# EAGLE design GRBL-Control (EAGLE 9.3.0)
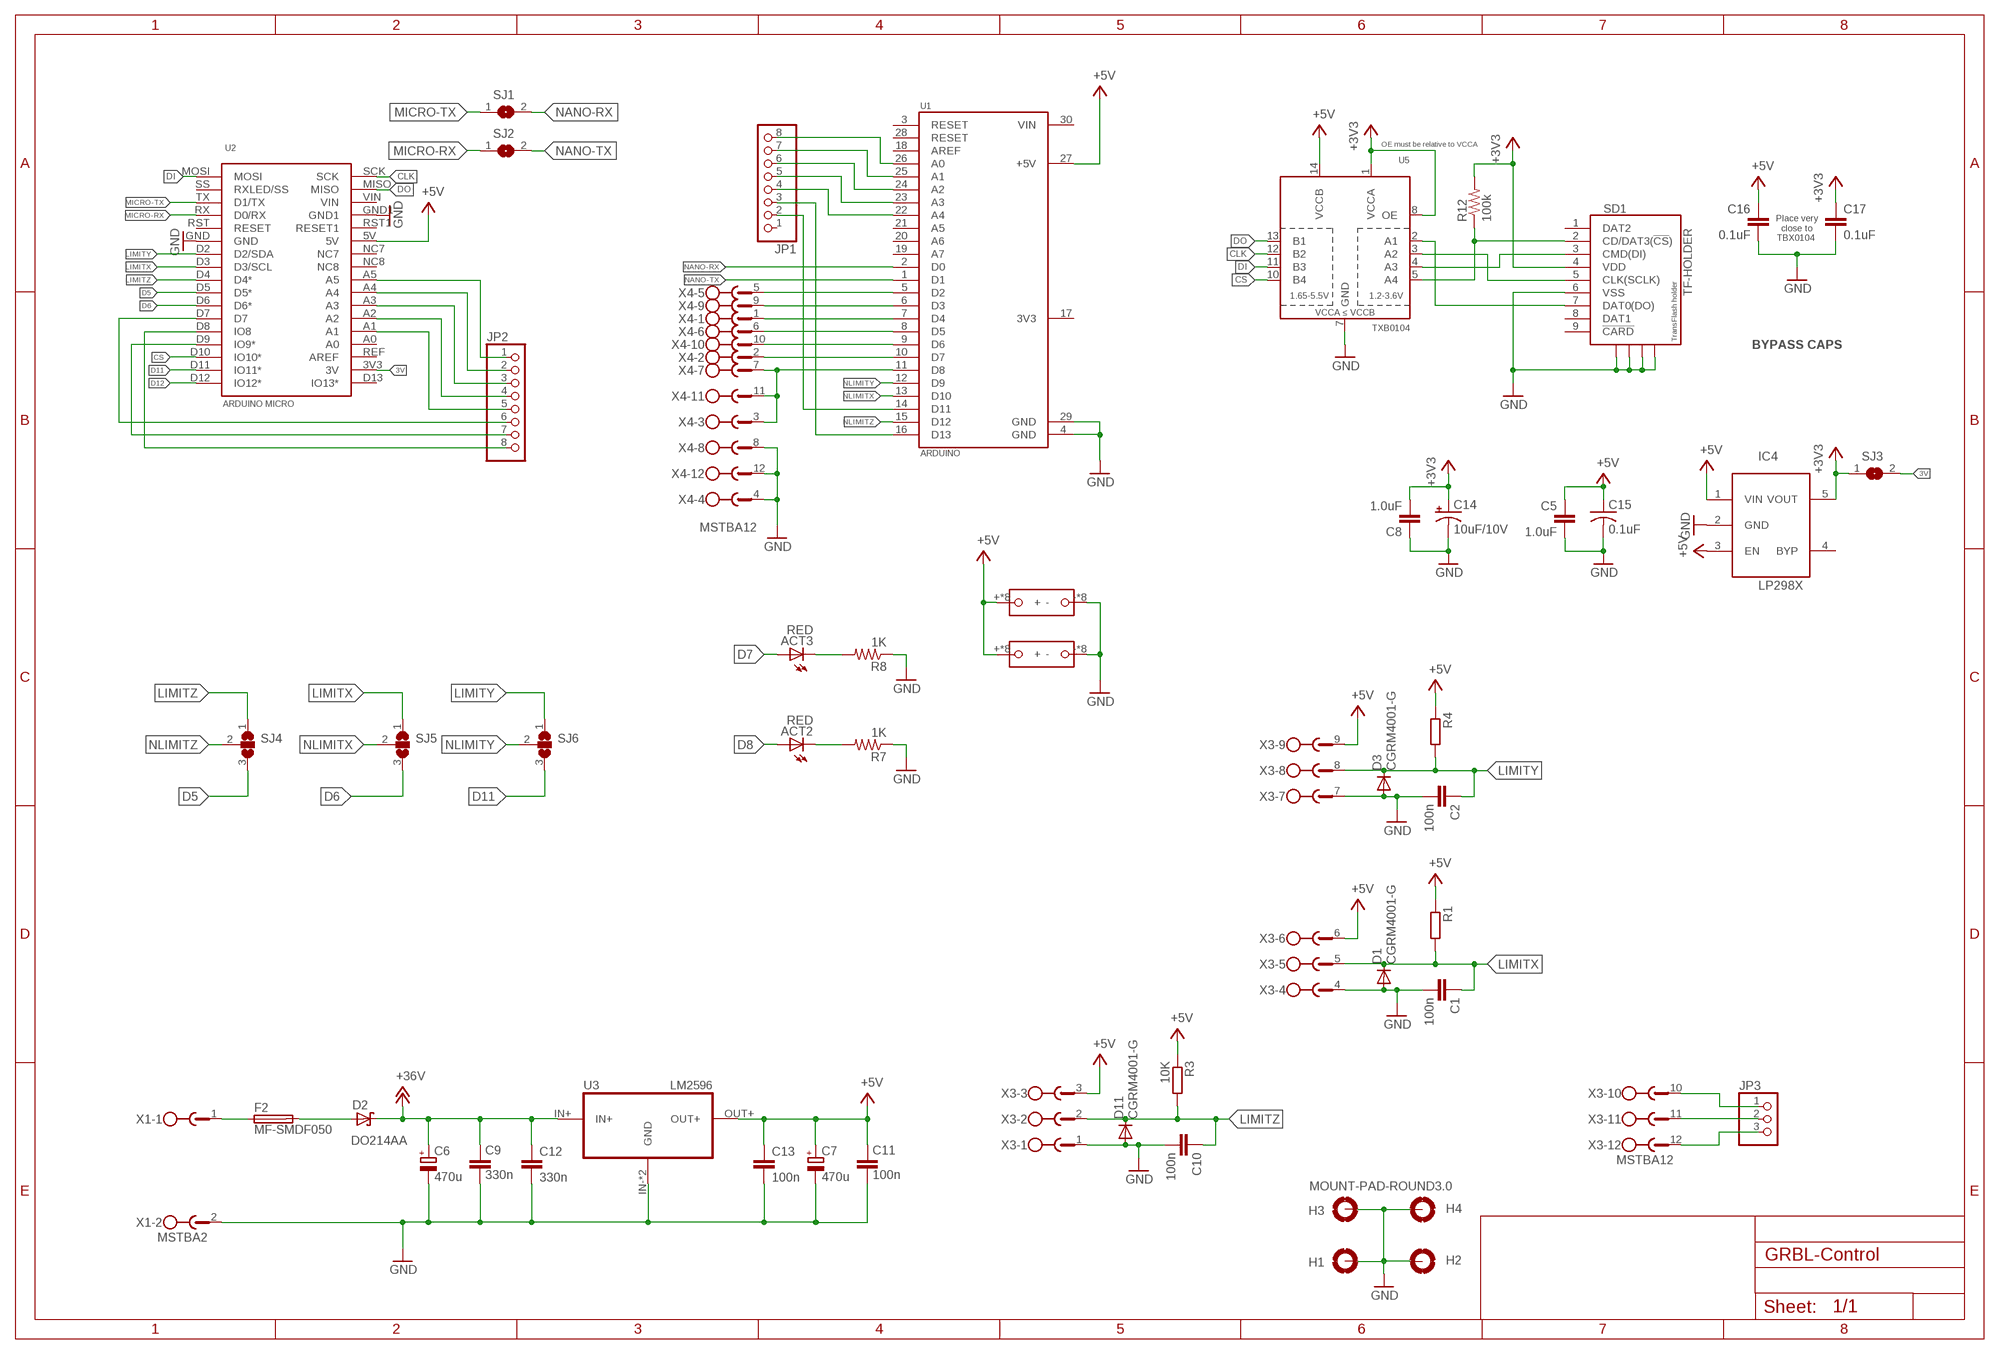
[diagram p0: schematic, sheet 1]

## Parts
ACT2  RED  LEDCHIP-LED0805  [CHIP-LED0805]
ACT3  RED  LEDCHIP-LED0805  [CHIP-LED0805]
C1  100n  C-EUC0603  [C0603]
C2  100n  C-EUC0603  [C0603]
C5  1.0uF  1.0UF-16V-10%(0603)  [0603-CAP]
C6  470u  CPOL-EUE3.5-8  [E3,5-8]
C7  470u  CPOL-EUE3.5-8  [E3,5-8]
C8  1.0uF  1.0UF-16V-10%(0603)  [0603-CAP]
C9  330n  C-EUC0603  [C0603]
C10  100n  C-EUC0603  [C0603]
C11  100n  C-EUC0603  [C0603]
C12  330n  C-EU050-025X075  [C050-025X075]
C13  100n  C-EU050-025X075  [C050-025X075]
C14  10uF/10V  CPOL-USA/3216-18R  [A/3216-18R]
C15  0.1uF  C-USC0805K  [C0805K]
C16  0.1uF  0.1UF-25V(+80/-20%)(0603)  [0603-CAP]
C17  0.1uF  0.1UF-25V(+80/-20%)(0603)  [0603-CAP]
D1  CGRM4001-G  [SOD-123_MINI-SMA]
D2  DO214AA  MBRS130LT3  [SMB]
D3  CGRM4001-G  [SOD-123_MINI-SMA]
D11  CGRM4001-G  [SOD-123_MINI-SMA]
F2  MF-SMDF050  [MF-SMDF050]
H1  MOUNT-PAD-ROUND3.0  [3,0-PAD]
H2  MOUNT-PAD-ROUND3.0  [3,0-PAD]
H3  MOUNT-PAD-ROUND3.0  [3,0-PAD]
H4  MOUNT-PAD-ROUND3.0  [3,0-PAD]
IC4  LP298XS  [SOT23-5L]
JP1  PINHD-1X8BIG  [1X08-BIG]
JP2  PINHD-1X8BIG  [1X08-BIG]
JP3  PINHD-1X3  [1X03]
R1  R-EU_R0603  [R0603]
R3  10K  R-EU_R0603  [R0603]
R4  R-EU_R0603  [R0603]
R7  1K  R-US_R0805  [R0805]
R8  1K  R-US_R0805  [R0805]
R12  100k  100KOHM-1/10W-1%(0603)  [0603-RES]
SD1  TF-HOLDER  [TF-PULL]
SJ1  SJ  [SJ]
SJ2  SJ  [SJ]
SJ3  SJ  [SJ]
SJ4  SJ2W  [SJ_2]
SJ5  SJ2W  [SJ_2]
SJ6  SJ2W  [SJ_2]
U1  ARDUINO  [ARDUINO_A000005]
U2  ARDUINO MICRO  ARDUINO_MICROFOOTPRINT  [ARDUINO-MICRO]
U3  LM2596  LM2596-DCDC  [BUCK-LM2596]
U5  TXB0104  TXB0104PWRSOIC14  [SO14]
U$1  DEV_GRID  [DEV_GRID]
U$2  DEV_GRID  [DEV_GRID]
X1  MSTBA2  [MSTBA2]
X3  MSTBA12  [MSTBA12]
X4  MSTBA12  [MSTBA12]

## Nets
3V: SJ3.2 U2.3V3(3V)
12V-IN: F2.1 X1.1
!CS_3V3: R12.1 SD1.2(CD/DAT3(!CS!)) U5.5(A4)
+3V3: C8.2 C14.+ C17.1 IC4.5(VOUT) R12.2 SD1.4(VDD) SJ3.1 U5.1(VCCA) U5.8(OE)
+5V: C5.1 C7.+ C11.1 C13.1 C15.1 C16.1 IC4.1(VIN) IC4.3(EN) R1.1 R3.1 R4.1 U1.27(+5V) U2.5V U3.OUT+ U5.14(VCCB) U$1.+ U$1.P$49(+) U$1.P$50(+) U$1.P$51(+) U$1.P$52(+) U$1.P$53(+) U$1.P$54(+) U$1.P$55(+) U$2.+ U$2.P$49(+) U$2.P$50(+) U$2.P$51(+) U$2.P$52(+) U$2.P$53(+) U$2.P$54(+) U$2.P$55(+) X3.3 X3.6 X3.9
+36V: C6.+ C9.1 C12.1 D2.C U3.IN+
A1: JP2.5 U2.A1
A2: JP2.4 U2.A2
A3: JP2.3 U2.A3
A4: JP2.2 U2.A4
A5: JP2.1 U2.A5
CLK: U2.SCK U5.12(B2)
CLK_3V3: SD1.5(CLK(SCLK)) U5.3(A2)
CS: U2.D10(IO10*) U5.10(B4)
D5: SJ4.3 U2.D5(D5*)
D6: SJ5.3 U2.D6(D6*)
D7: ACT3.A JP2.6 U2.D7
D8: ACT2.A JP2.8 U2.D8(IO8)
D9: JP2.7 U2.D9(IO9*)
D11: SJ6.3 U2.D11(IO11*)
D12: U2.D12(IO12*)
DI: U2.MOSI U5.11(B3)
DI_3V3: SD1.3(CMD(DI)) U5.4(A3)
DIRX: U1.8(D5) X4.6
DIRY: U1.9(D6) X4.10
DO: U2.MISO U5.13(B1)
DO_3V3: SD1.7(DAT0(DO)) U5.2(A1)
GND: C1.2 C2.2 C5.2 C6.- C7.- C8.1 C9.2 C10.2 C11.2 C12.2 C13.2 C14.- C15.2 C16.2 C17.2 D1.A D3.A D11.A H1.B3,0(MOUNT) H1.P$1(MOUNT) H1.P$2(MOUNT) H1.P$3(MOUNT) H1.P$4(MOUNT) H1.P$5(MOUNT) H1.P$6(MOUNT) H1.P$7(MOUNT) H1.P$8(MOUNT) H2.B3,0(MOUNT) H2.P$1(MOUNT) H2.P$2(MOUNT) H2.P$3(MOUNT) H2.P$4(MOUNT) H2.P$5(MOUNT) H2.P$6(MOUNT) H2.P$7(MOUNT) H2.P$8(MOUNT) H3.B3,0(MOUNT) H3.P$1(MOUNT) H3.P$2(MOUNT) H3.P$3(MOUNT) H3.P$4(MOUNT) H3.P$5(MOUNT) H3.P$6(MOUNT) H3.P$7(MOUNT) H3.P$8(MOUNT) H4.B3,0(MOUNT) H4.P$1(MOUNT) H4.P$2(MOUNT) H4.P$3(MOUNT) H4.P$4(MOUNT) H4.P$5(MOUNT) H4.P$6(MOUNT) H4.P$7(MOUNT) H4.P$8(MOUNT) IC4.2(GND) R7.1 R8.1 SD1.6(VSS) SD1.S1 SD1.S2 SD1.S3 SD1.S4 U1.4(GND) U1.29(GND) U2.GND U2.GND1 U3.IN-(GND) U3.OUT-(GND) U5.7(GND) U$1.- U$1.P$57(-) U$1.P$58(-) U$1.P$59(-) U$1.P$60(-) U$1.P$61(-) U$1.P$62(-) U$1.P$63(-) U$2.- U$2.P$57(-) U$2.P$58(-) U$2.P$59(-) U$2.P$60(-) U$2.P$61(-) U$2.P$62(-) U$2.P$63(-) X1.2 X3.1 X3.4 X3.7 X4.4 X4.8 X4.12
LIMITX: C1.1 D1.C R1.2 SJ5.1 U2.D3(D3/SCL) X3.5
LIMITY: C2.1 D3.C R4.2 SJ6.1 U2.D2(D2/SDA) X3.8
LIMITZ: C10.1 D11.C R3.2 SJ4.1 U2.D4(D4*) X3.2
MICRO-RX: SJ2.1 U2.RX(D0/RX)
MICRO-TX: SJ1.1 U2.TX(D1/TX)
N$1: ACT2.C R7.2
N$2: ACT3.C R8.2
N$3: D2.A F2.2
N$4: U1.7(D4) X4.1
N$5: U1.10(D7) X4.2
N$6: JP1.8 U1.26(A0)
N$7: JP1.7 U1.25(A1)
N$8: JP1.6 U1.24(A2)
N$9: JP1.5 U1.23(A3)
N$10: JP1.4 U1.22(A4)
N$11: JP1.3 U1.16(D13)
N$12: JP1.2 U1.14(D11)
N$13: JP3.1 X3.10
N$14: JP3.2 X3.11
N$15: JP3.3 X3.12
NANO-RX: SJ1.2 U1.2(D0)
NANO-TX: SJ2.2 U1.1(D1)
NLIMITX: SJ5.2 U1.13(D10)
NLIMITY: SJ6.2 U1.12(D9)
NLIMITZ: SJ4.2 U1.15(D12)
STEP-EN: U1.11(D8) X4.3 X4.7 X4.11
STEPX: U1.5(D2) X4.5
STEPY: U1.6(D3) X4.9
Unconnected: IC4.4(BYP) JP1.1 SD1.1(DAT2) SD1.8(DAT1) SD1.9(!CARD) U1.3(RESET) U1.17(3V3) U1.18(AREF) U1.19(A7) U1.20(A6) U1.21(A5) U1.28(RESET) U2.A0 U2.D13(IO13*) U2.NC7 U2.NC8 U2.REF(AREF) U2.RST1(RESET1) U2.RST(RESET) U2.SS(RXLED/SS) U2.VIN

## Notes on the sheet
- OE must be relative to VCCA
- Place very
  close to
  TBX0104
- BYPASS CAPS

## Power pins joined to a net without a drawn wire
VIN: U1.30(VIN)

## Library data of the parts
ACT2 ACT3 = adafruit:LED: LED OSRAM: - CHIPLED LG R971, LG N971, LY N971, LG Q971, LY Q971, LO R971, LY R971 LH N974, LH R974 LS Q976, LO Q976, LY Q976 LO Q996 - Hyper CHIPLED LW Q18S LB Q993, LB Q99A, LB R99A - SideLED LS A670, LO A670, LY A670, LG A670, LP A670 LB A673, LV A673, LT A673, LW A673 LH A674 LY A675 LS A676, LA A676, LO A676, LY A676, LW A676 LS A679, LY A679, LG A679 - Hyper Micro SIDELED® LS Y876, LA Y876, LO Y876, LY Y876 LT Y87S - SmartLED LW L88C, LW L88S LB L89C, LB L89S, LG L890 LS L89K, LO L89K, LY L89K LS L896, LA L896, LO L896, LY L896 - TOPLED LS T670, LO T670, LY T670, LG T670, LP T670 LSG T670, LSP T670, LSY T670, LOP T670, LYG T670 LG T671, LOG T671, LSG T671 LB T673, LV T673, LT T673, LW T673 LH T674 LS T676, LA T676, LO T676, LY T676, LB T676, LH T676, LSB T676, LW T676 LB T67C, LV T67C, LT T67C, LS T67K, LO T67K, LY T67K, LW E67C LS E67B, LA E67B, LO E67B, LY E67B, LB E67C, LV E67C, LT E67C LW T67C LS T679, LY T679, LG T679 LS T770, LO T770, LY T770, LG T770, LP T770 LB T773, LV T773, LT T773, LW T773 LH T774 LS E675, LA E675, LY E675, LS T675 LS T776, LA T776, LO T776, LY T776, LB T776 LHGB T686 LT T68C, LB T68C - Hyper Mini TOPLED® LB M676 - Mini TOPLED Santana® LG M470 LS M47K, LO M47K, LY M47K Source: http://www.osram.convergy.de/
C1 C2 C9-C11 = Parts:C-EU: CAPACITOR, European symbol
C5 C8 = SparkFun-Capacitors:1.0UF-16V-10%(0603): CAP-00868; PROD_ID: CAP-00868
C6 C7 = RavinLib:CPOL-EU: POLARIZED CAPACITOR, European symbol
C12 C13 = RavinLib:C-EU: CAPACITOR, European symbol
C14 = adafruit:CPOL-US: POLARIZED CAPACITOR, American symbol
C15 = adafruit:C-US: CAPACITOR, American symbol
C16 C17 = SparkFun-Capacitors:0.1UF-25V(+80/-20%)(0603): CAP-00810 Ceramic Standard decoupling cap; PROD_ID: CAP-00810
D1 D3 D11 = Parts:CGRM400*-G: Molded plasitc,JEDEC SOD-123/Mini SMA Source: Comchip CGRM4001-G.pdf
D2 = diode:MBRS130LT3: Schottky Power Rectifier Source: http://www.onsemi.com/pub/Collateral/MBRS130LT3-D.PDF; PART-NO: DO214AA
F2 = fuse:MF-SMDF: MF-SMDF Series - PRC Resettable Fuses Source: http://www.farnell.com/datasheets/716597.pdf
H1-H4 = QuestNode:MOUNT-PAD-ROUND: MOUNTING PAD, round
IC4 = adafruit:LP298X
JP1 JP2 = adafruit:PINHD-1X8: PIN HEADER
JP3 = pinhead:PINHD-1X3: PIN HEADER
R1 R3 R4 = Parts:R-EU_: RESISTOR, European symbol
R7 R8 = adafruit:R-US_: RESISTOR, American symbol
R12 = SparkFun-Resistors:100KOHM-1/10W-1%(0603): RES-07828; PROD_ID: RES-07828
SD1 = sd-mmc:TF-HOLDER: TF / Micro SD socket is PUSH-PUSH type, the card can be pushed into and auto locked and pushed out by simply press the card. Surface Mounting type.
SJ1-SJ3 = jumper:SJ: SMD solder JUMPER
SJ4-SJ6 = jumper:SJ2W: SMD solder JUMPER
U1 = Parts:ARDUINO: MICRO, ARDUINO NANO 3.0, MINI-B USB, ATmega328, 0.1"DIP, ICSP HDR
U2 = arduino-micro:ARDUINO_MICRO
U3 = QuestNode:LM2596-DCDC
U5 = SparkFun-DigitalIC:TXB0104PWR: 4-Bit Bi-Directional Level Shifter 1.2V-3.6V (VCCA) to 1.65V-5.5V (VCCB) bi-directional level shifter with auto direction sensing. Max data rate - VCCA 1.8V: 20Mbps (50ns), VCCA 3.3V: 100Mbps (10ns) Digikey: 296-21929-1-ND (TSSOP) IC-11329; PROD_ID: IC-11329
U$1 U$2 = Components:DEV_GRID
X1 = Parts:MSTBA2: PHOENIX; MF: FARNELL; MPN: 1757242; OC_FARNELL: 3705171; OC_NEWARK: 71C4161
X3 X4 = con-phoenix-508:MSTBA12: PHOENIX; MPN: 1757349; OC_FARNELL: 3705250; OC_NEWARK: 71C4169

## Board
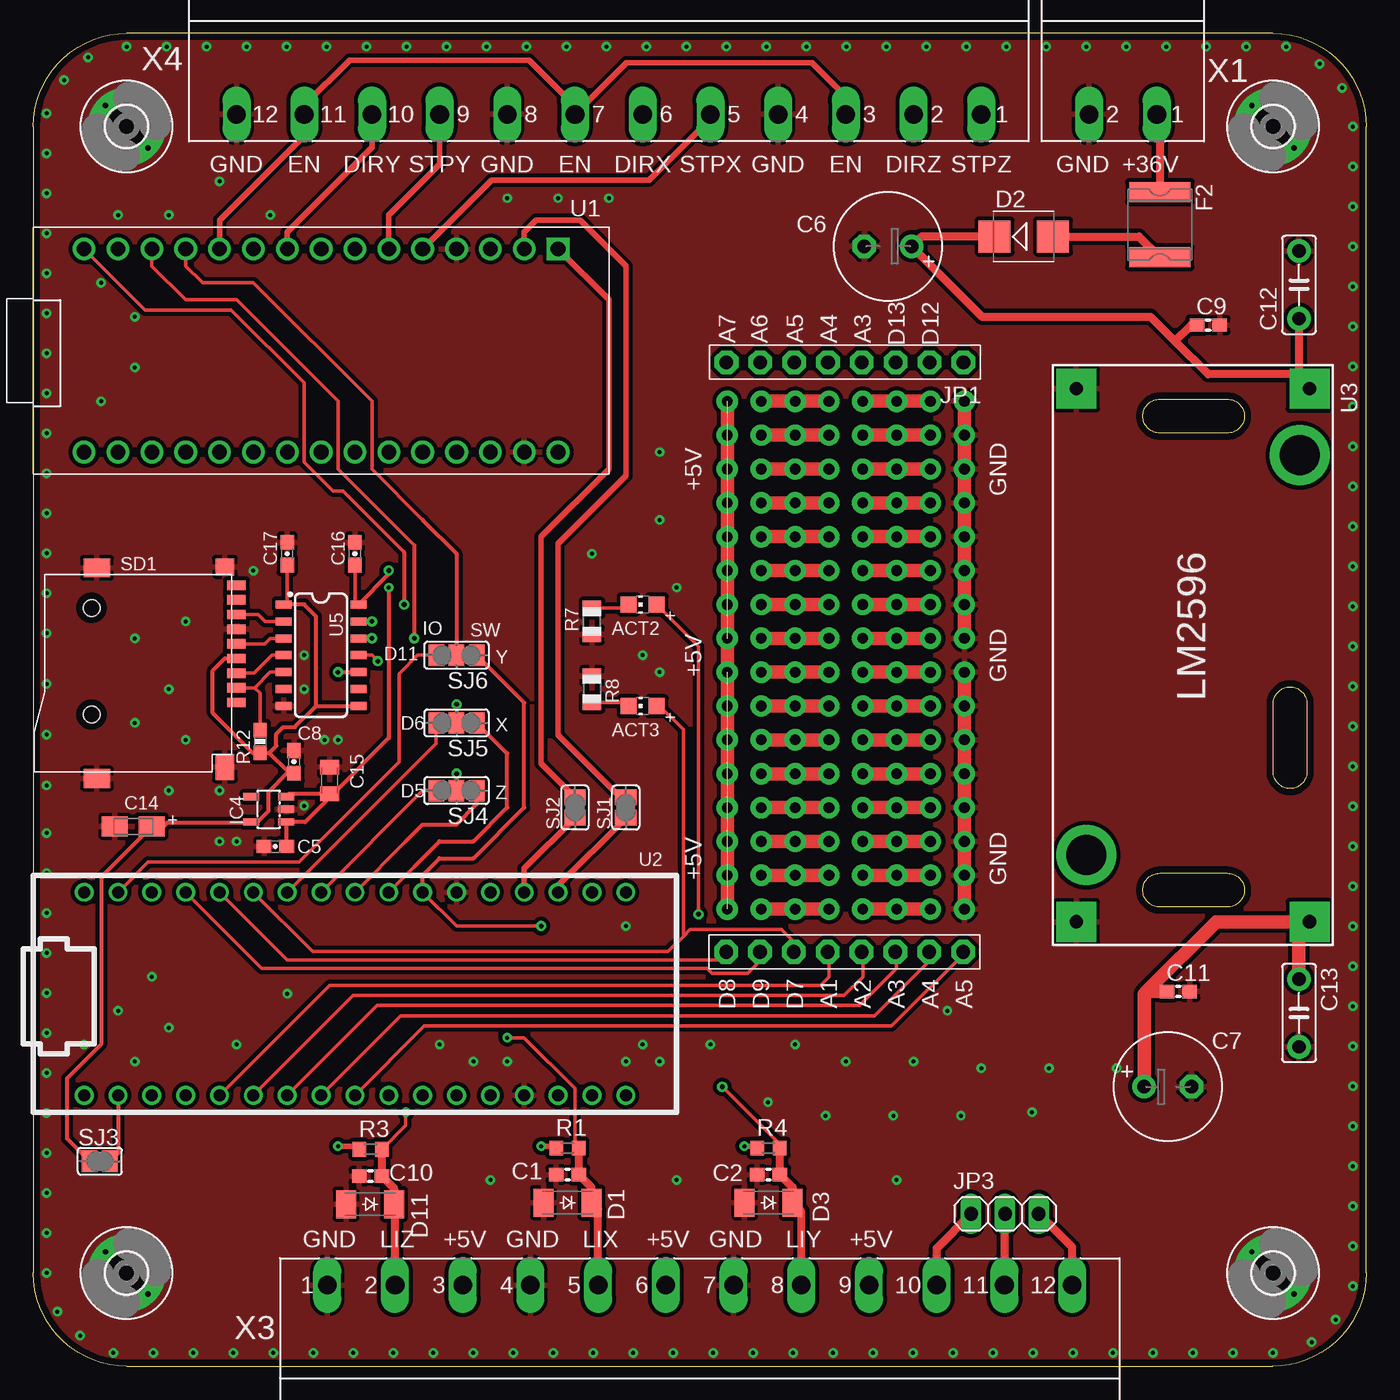
[diagram p1: board, top side]
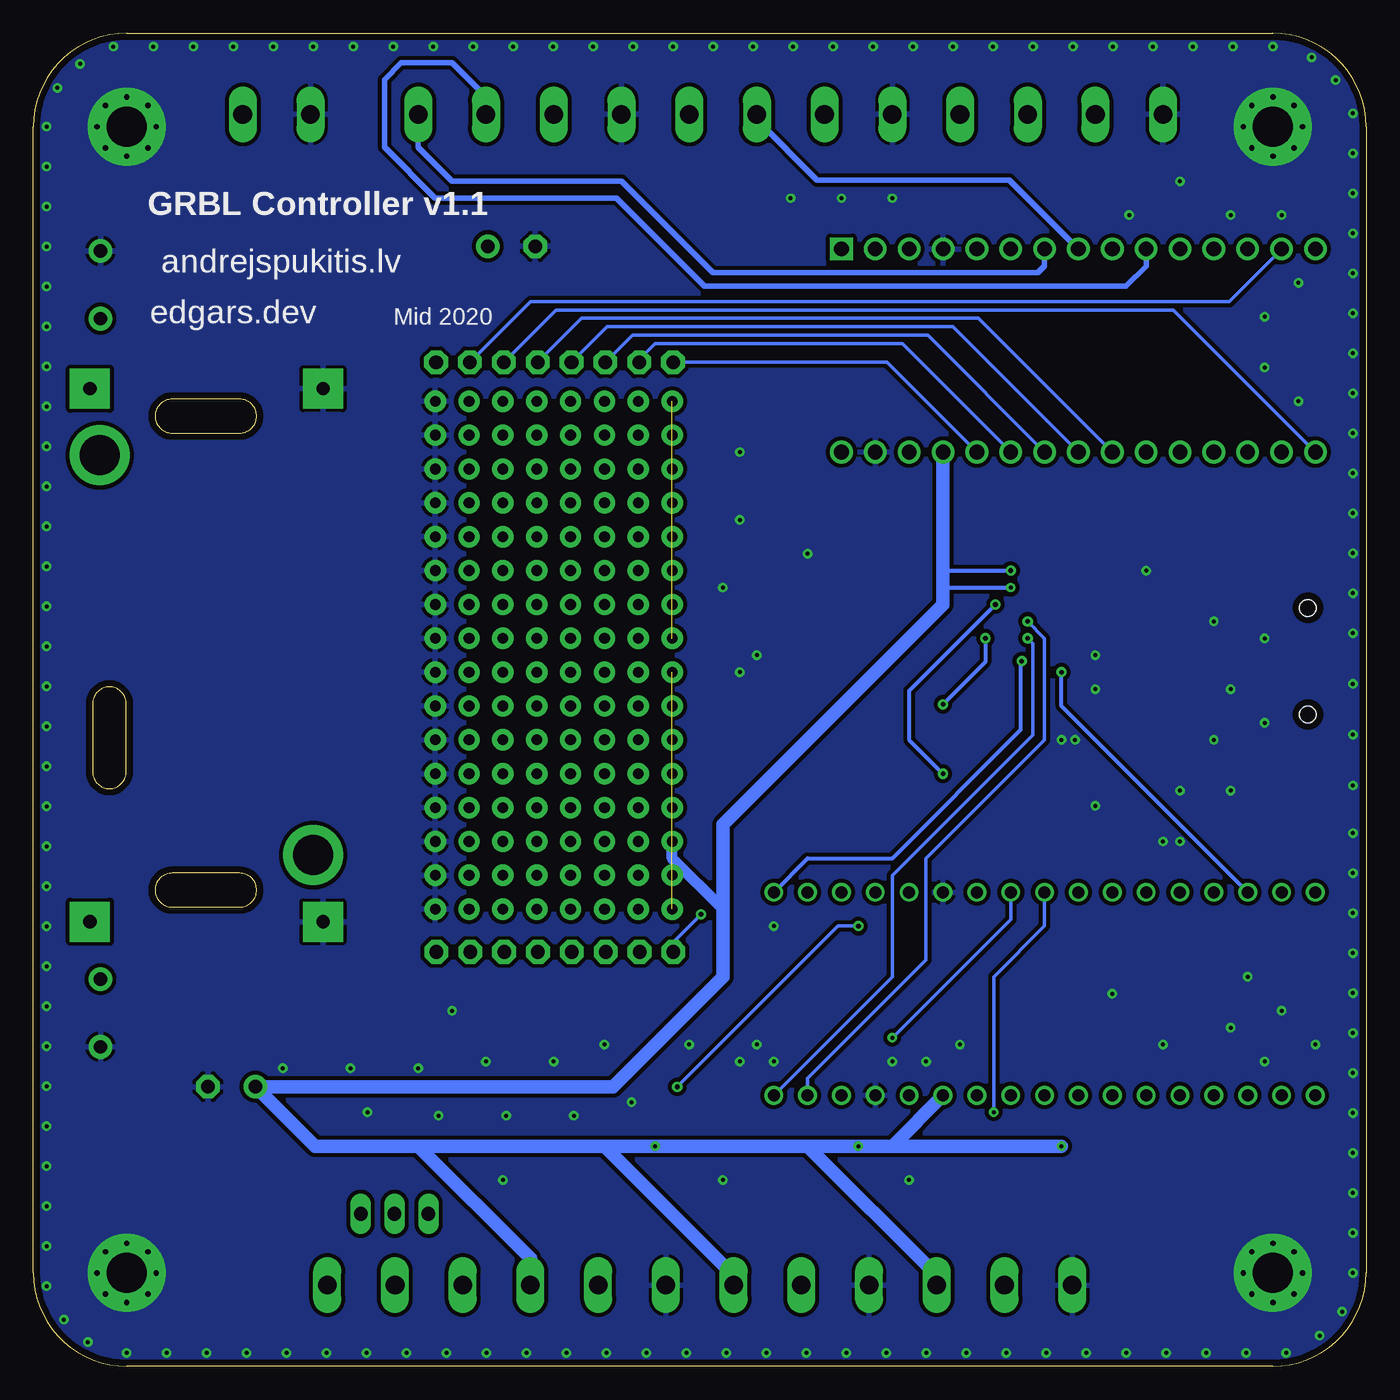
[diagram p2: board, bottom side, seen from below]

Size 100 x 100 mm. Coordinates in mm from the lower left corner, seen from the top.
Outline: 7,0 93,0 arc90 100,7 100,93 arc90 93,100 7,100 arc90 0,93 0,7 arc90 7,0
Copper layers (1*16): Top 0.035mm / dielectric 1.5mm / Bottom 0.035mm
Design rules "default *": minimum track width 6mil, minimum drill 0.3mm, track to track 12mil, track to pad 12mil, pad to pad 6mil, via to via 6mil, smd to smd 6mil, copper to edge 20mil, drill to drill 6mil, minimum pad ring 10mil, minimum via ring 8mil, stop-mask expansion 4mil, vias tented up to drill 0.3mm, thermal gap 10mil

### Footprints (pad centres in the part's own frame; a part is rotated, then mirrored left to right if it is on the bottom)
CHIP-LED0805 = smd 1.2 x 1.2: A 0,-1.05; C 0,1.05
C0603 = smd 1.1 x 1: 1 -0.85,0; 2 0.85,0
0603-CAP = smd 1.1 x 1: 1 -0.85,0; 2 0.85,0
E3,5-8 = drill 1 pad 1.778: + -1.778,0 | drill 1 pad 1.778 octagon: - 1.778,0
C050-025X075 = drill 1 pad 1.778: 1 -2.54,0; 2 2.54,0
A/3216-18R = smd 1.95 x 1.5: + 1.375,0; - -1.375,0
C0805K = smd 1.1 x 1.4: 1 -1,0; 2 1,0
SOD-123_MINI-SMA = smd 1.5 x 2.1: A 1.8,0; C -1.8,0
SMB = smd 2.4 x 2.4: A 2.2,0; C -2.2,0
MF-SMDF050 = smd 1.5 x 4.6: 1 -2.45,0; 2 2.45,0
3,0-PAD = drill 3 pad 5.842: B3,0 0,0 | drill 0.4: P$1 0,2.223; P$2 0,-2.223; P$3 -2.223,0; P$4 2.223,0; P$5 -1.587,1.587; P$6 -1.587,-1.587; P$7 1.587,-1.587; P$8 1.587,1.587
SOT23-5L = smd 0.55 x 1.2: 1 -0.95,-1.3; 2 0,-1.3; 3 0.95,-1.3; 4 0.95,1.3; 5 -0.95,1.3
1X08-BIG = drill 1.016 pad 1.778 octagon: 1 -8.89,0; 2 -6.35,0; 3 -3.81,0; 4 -1.27,0; 5 1.27,0; 6 3.81,0; 7 6.35,0; 8 8.89,0
1X03 = drill 1.016 long: 1 -2.54,0; 2 0,0; 3 2.54,0
R0603 = smd 1 x 1.1: 1 -0.85,0; 2 0.85,0
R0805 = smd 1.1 x 1.4: 1 -1,0; 2 1,0
0603-RES = smd 1.1 x 1: 1 -0.85,0; 2 0.85,0
TF-PULL = smd 0.7 x 1.4: 1 -2.2,-7.62; 2 -1.1,-7.62; 3 0,-7.62; 4 1.1,-7.62; 5 2.2,-7.62; 6 3.3,-7.62; 7 4.4,-7.62; 8 5.5,-7.62; 9 6.6,-7.62 | smd 1.4 x 2: S1 -7.9,2.85; S2 7.9,2.85 | smd 1.28 x 1.4: S3 7.96,-6.75 | smd 1.95 x 1.4: S4 -7.025,-6.75 | hole 1.25: -3.1,3.25; 4.9,3.25
SJ = smd 1.168 x 1.6: 1 -0.762,0; 2 0.762,0
SJ_2 = smd 1.168 x 1.6: 1 -1.524,0; 2 0,0; 3 1.524,0
ARDUINO_A000005 = drill 1.1 pad 1.7 square: 1 -7.62,17.78 | drill 1.1 pad 1.7: 2 -7.62,15.24; 3 -7.62,12.7; 4 -7.62,10.16; 5 -7.62,7.62; 6 -7.62,5.08; 7 -7.62,2.54; 8 -7.62,0; 9 -7.62,-2.54; 10 -7.62,-5.08; 11 -7.62,-7.62; 12 -7.62,-10.16; 13 -7.62,-12.7; 14 -7.62,-15.24; 15 -7.62,-17.78; 16 7.62,-17.78; 17 7.62,-15.24; 18 7.62,-12.7; 19 7.62,-10.16; 20 7.62,-7.62; 21 7.62,-5.08; 22 7.62,-2.54; 23 7.62,0; 24 7.62,2.54; 25 7.62,5.08; 26 7.62,7.62; 27 7.62,10.16; 28 7.62,12.7; 29 7.62,15.24; 30 7.62,17.78
ARDUINO-MICRO = drill 0.9: 3V3 16.51,3.81; 5V 16.51,29.21; A0 16.51,8.89; A1 16.51,11.43; A2 16.51,13.97; A3 16.51,16.51; A4 16.51,19.05; A5 16.51,21.59; D2 1.27,26.67; D3 1.27,24.13; D4 1.27,21.59; D5 1.27,19.05; D6 1.27,16.51; D7 1.27,13.97; D8 1.27,11.43; D9 1.27,8.89; D10 1.27,6.35; D11 1.27,3.81; D12 1.27,1.27; D13 16.51,1.27; GND 1.27,29.21; GND1 16.51,34.29; MISO 16.51,39.37; MOSI 1.27,41.91; NC7 16.51,26.67; NC8 16.51,24.13; REF 16.51,6.35; RST 1.27,31.75; RST1 16.51,31.75; RX 1.27,34.29; SCK 16.51,41.91; SS 1.27,39.37; TX 1.27,36.83; VIN 16.51,36.83
BUCK-LM2596 = drill 1 pad 3 square: IN+ 1.75,19.25; IN- 1.75,1.75; OUT+ 41.75,19.25; OUT- 41.75,1.75 | drill 3 pad 4.5: NC1 6.75,18.5; NC2 36.75,2.5
SO14 = smd 0.6 x 1.2: 1 -3.81,-2.8; 2 -2.54,-2.8; 3 -1.27,-2.8; 4 0,-2.8; 5 1.27,-2.8; 6 2.54,-2.8; 7 3.81,-2.8; 8 3.81,2.8; 9 2.54,2.8; 10 1.27,2.8; 11 0,2.8; 12 -1.27,2.8; 13 -2.54,2.8; 14 -3.81,2.8
DEV_GRID = drill 0.8 pad 1.6: + -10.16,-16.51; - 7.62,-16.51; P$1 0,1.27; P$2 -7.62,1.27; P$3 -5.08,1.27; P$4 -2.54,1.27; P$5 2.54,1.27; P$6 5.08,1.27; P$7 -7.62,-1.27; P$8 -5.08,-1.27; P$9 -2.54,-1.27; P$10 0,-1.27; P$11 2.54,-1.27; P$12 5.08,-1.27; P$13 -7.62,-3.81; P$14 -5.08,-3.81; P$15 -2.54,-3.81; P$16 0,-3.81; P$17 2.54,-3.81; P$18 5.08,-3.81; P$19 -7.62,-6.35; P$20 -5.08,-6.35; P$21 -2.54,-6.35; P$22 0,-6.35; P$23 2.54,-6.35; P$24 5.08,-6.35; P$25 -7.62,-8.89; P$26 -5.08,-8.89; P$27 -2.54,-8.89; P$28 0,-8.89; P$29 2.54,-8.89; P$30 5.08,-8.89; P$31 -7.62,-11.43; P$32 -5.08,-11.43; P$33 -2.54,-11.43; P$34 0,-11.43; P$35 2.54,-11.43; P$36 5.08,-11.43; P$37 -7.62,-13.97; P$38 -5.08,-13.97; P$39 -2.54,-13.97; P$40 0,-13.97; P$41 2.54,-13.97; P$42 5.08,-13.97; P$43 -7.62,-16.51; P$44 -5.08,-16.51; P$45 -2.54,-16.51; P$46 0,-16.51; P$47 2.54,-16.51; P$48 5.08,-16.51; P$49 -10.16,1.27; P$50 -10.16,-1.27; P$51 -10.16,-3.81; P$52 -10.16,-6.35; P$53 -10.16,-8.89; P$54 -10.16,-11.43; P$55 -10.16,-13.97; P$57 7.62,1.27; P$58 7.62,-1.27; P$59 7.62,-3.81; P$60 7.62,-6.35; P$61 7.62,-8.89; P$62 7.62,-11.43; P$63 7.62,-13.97
MSTBA2 = drill 1.397 long: 1 -2.54,5.08; 2 2.54,5.08
MSTBA12 = drill 1.397 long: 1 -27.94,5.08; 2 -22.86,5.08; 3 -17.78,5.08; 4 -12.7,5.08; 5 -7.62,5.08; 6 -2.54,5.08; 7 2.54,5.08; 8 7.62,5.08; 9 12.7,5.08; 10 17.78,5.08; 11 22.86,5.08; 12 27.94,5.08

### Placement (x,y rotation side)
ACT2  45.72,57.15 90 top
ACT3  45.72,49.53 90 top
C1  40.08,14.37 180 top
C2  55.16,14.37 180 top
C5  18.16,38.99 180 top
C6  64.12,84.02 180 top
C7  85.12,20.97 0 top
C8  19.56,45.34 270 top
C9  88.15,78.11 0 top
C10  25.3,14.26 180 top
C11  85.91,28.11 0 top
C12  94.96,81.13 90 top
C13  94.96,26.5 270 top
C14  7.49,40.51 0 top
C15  22.23,43.94 90 top
C16  24.13,60.96 90 top
C17  19.05,60.96 90 top
D1  40.08,12.27 180 top
D2  74.31,84.76 0 top
D3  55.16,12.27 180 top
D11  25.26,12.16 180 top
F2  84.52,85.64 270 top
H1  7,7 0 top
H2  7,93 0 top
H3  93,7 0 top
H4  93,93 0 top
IC4  17.65,41.78 90 top
JP1  60.89,75.32 180 top
JP2  60.87,31.08 180 top
JP3  72.9,11.43 0 top
R1  40.08,16.37 0 top
R3  25.3,16.27 0 top
R4  55.16,16.37 0 top
R7  41.91,55.88 90 top
R8  41.91,50.8 270 top
R12  17.02,46.86 270 top
SD1  7.62,52 90 top
SJ1  44.45,41.91 90 top
SJ2  40.64,41.91 90 top
SJ3  4.99,15.38 0 top
SJ4  31.75,43.18 180 top
SJ5  31.75,48.26 180 top
SJ6  31.75,53.34 180 top
U1  21.59,76.2 270 top
U2  2.54,36.83 270 top
U3  76.51,75.09 270 top
U5  21.59,53.34 270 top
U$1  62.23,71.12 0 top
U$2  62.23,50.8 0 top
X1  81.75,99 180 top
X3  50,1 0 top
X4  43.18,99 180 top

### Tracks (layer width: path | path; a pad name or v marks a point on that pad's centre or on a via)
3V
  Top 0.305: U2.3V3 6.35,15.98 SJ3.2
12V-IN
  Top 0.61: X1.1 84.52,93.69 F2.1
!CS_3V3
  Top 0.254: U5.5 17.78,52.07 16.61,50.9 | 16.61,50.9 SD1.2 | R12.1 17.02,50.49 16.61,50.9
+3V3
  Top 0.254: U5.1 19.05,57.41 C17.1
  Top 0.305: SJ3.1 2.54,17.07 2.54,21.59 5.08,24.13 5.08,36.72 C14.+ 9.78,40.51 10.03,40.76 16.29,40.76 IC4.5 16.82,40.83 17.65,41.66 17.65,43.09 19.05,44.49 C8.2 19.22,44.49 17.69,46.01 | 17.69,46.01 R12.2 17.36,46.01 17.4,45.97 16.51,45.97 13.46,49.02 13.46,52.2 14.37,53.1 SD1.4 | 17.69,46.01 18.22,46.55 18.22,47.43 18.73,47.94 19.62,47.94 21.21,49.53 | 21.21,49.53 U5.8 | 21.21,49.53 21.21,56.26 20.32,57.15 U5.1
+5V  (via drill 0.3, 0.35)  (14 unrouted)
  Top 0.254: U5.14 24.13,57.41 C16.1
  Top 0.305: v26.67,58.42 26.67,47.12 22.5,42.94 C15.1 | C15.1 19.17,42.94 IC4.3 | C15.1 22.23,42.68 20.38,40.83 19.05,40.83 | 19.05,40.83 IC4.1 | C5.1 19.01,40.79 19.05,40.83 | v26.67,59.69 26.67,59.43 U5.14
  Top 0.406: v22.86,16.51 24.21,16.51 R3.1 | v38.1,16.51 39.09,16.51 R1.1 | v53.34,16.51 54.17,16.51 R4.1
  Top 1.016: C13.1 94.96,33.23 95.72,33.3 U3.OUT+ 88.74,33.34 83.51,28.11 | C7.+ 83.34,27.94 83.51,28.11 | C11.1 83.51,28.11 | U$2.P$49 U$1.+
  Bottom 0.305: 31.75,58.42 v26.67,58.42 | 31.75,59.69 v26.67,59.69
  Bottom 0.813: 48.26,34.29 52.07,38.1 U$2.P$54
  Bottom 1.016: C7.+ 83.31,20.97 | 83.31,20.97 56.5,20.97 48.26,29.21 48.26,34.29 48.26,40.64 31.75,57.15 31.75,58.42 31.75,59.69 U1.27 | 83.31,20.97 78.85,16.51 71.12,16.51 | 71.12,16.51 57.15,16.51 | 57.15,16.51 v53.34,16.51 41.91,16.51 | 41.91,16.51 v38.1,16.51 | v38.1,16.51 35.56,16.51 U2.5V | v38.1,16.51 v22.86,16.51 | 41.91,16.51 32.22,6.82 X3.3 | X3.6 47.46,6.82 57.15,16.51 | 71.12,16.51 62.7,8.09 X3.9
+36V
  Top 0.61: D2.C 66.64,84.76 C6.+ 71.18,78.74 83.82,78.74 85.66,76.9 | 85.66,76.9 88.14,74.42 94.68,74.42 U3.IN+ 94.96,73.34 C12.1 | 85.66,76.9 86.87,78.11 C9.1
A1
  Top 0.254: U2.A1 22.23,28.57 59.05,28.57 59.69,29.21 59.69,30.99 JP2.5
A2
  Top 0.254: U2.A2 24,27.81 39.37,27.81 39.75,27.81 60.83,27.81 62.23,29.21 62.23,30.99 JP2.4
A3
  Top 0.254: U2.A3 25.78,27.05 61.98,27.05 64.77,29.84 64.77,30.99 JP2.3
A4
  Top 0.254: U2.A4 27.56,26.29 63.12,26.29 67.31,30.48 67.31,30.99 JP2.2
A5
  Top 0.254: U2.A5 29.34,25.53 64.39,25.53 69.85,30.99 JP2.1
CLK  (via drill 0.35)
  Top 0.254: v25.4,54.61 U5.12
  Bottom 0.254: U2.SCK 35.56,29.21 35.56,36.83 25.02,47.37 25.02,54.23 v25.4,54.61
CLK_3V3
  Top 0.254: U5.3 17.78,54.61 17.37,54.2 SD1.5
CS  (via drill 0.35)
  Top 0.305: v22.86,52.07 U5.10
  Bottom 0.305: U2.D10 22.86,49.53 v22.86,52.07
D5
  Top 0.254: U2.D5 29.21,43.18 SJ4.3
D6
  Top 0.254: U2.D6 30.23,46.74 SJ5.3
D7
  Top 0.254: U2.D7 20.95,31.11 47.62,31.11 48.77,32.26 | 48.77,32.26 49.28,32.77 56.13,32.77 57.15,31.75 57.15,31.17 JP2.6 | 48.77,32.26 48.77,47.75 46.99,49.53 ACT3.A
D8  (via drill 0.35)
  Top 0.254: U2.D8 19.05,30.48 52.07,30.48 52.07,30.99 JP2.8 | v49.91,33.91 49.91,54.01 ACT2.A
  Bottom 0.254: JP2.8 51.98,31.84 v49.91,33.91
D9
  Top 0.254: U2.D9 17.14,29.84 50.55,29.84 50.93,29.46 53.59,29.46 54.61,30.48 54.61,30.99 JP2.7
D11
  Top 0.254: SJ6.3 28.83,53.34 27.43,51.94 27.43,45.34 19.94,37.85 13.97,37.85 13.72,37.85 8.64,37.85 U2.D11
DI  (via drill 0.35)
  Top 0.254: v25.84,52.9 25.4,53.34 U5.11
  Bottom 0.305: v25.84,52.9 25.91,52.83 25.91,47.75 35.56,38.1 41.91,38.1 U2.MOSI
DI_3V3
  Top 0.254: U5.4 17.91,53.34 16.57,52 SD1.3
DIRX
  Bottom 0.406: U1.8 26.77,89 41.19,89 45.72,93.53 X4.6
DIRY
  Top 0.406: U1.9 19.05,85.09 24.13,90.17 24.42,90.46 25.4,91.44 X4.10
DO  (via drill 0.35)
  Top 0.254: v25.4,55.88 U5.13
  Bottom 0.254: U2.MISO 41.91,21.59 33.02,30.48 33.02,38.1 24.13,46.99 24.13,54.61 v25.4,55.88
DO_3V3
  Top 0.254: U5.2 17.4,55.88 16.88,56.4 SD1.7
GND  (via drill 0.3)
  other vias: 71.12,22.35 76.2,22.35 81.28,22.35 74.93,19.05 55.12,19.81 59.44,18.8 64.52,18.8 69.6,18.8 7,99 10,99 13,99 16,99 19,99 2.3,96.5 4.1,98.2 1,82 1,85 1,88 1,91 1,94 1,67 1,70 1,73 1,76 1,79 1,55 1,58 1,61 1,64 1,37 1,40 1,22 1,25 1,28 1,31 1,34 1,7 1,10 1,13 1,16 1,19 3.5,2.3 1.8,4.1 6,1 9,1 12,1 15,1 18,1 21,1 24,1 27,1 30,1 33,1 36,1 39,1 42,1 45,1 48,1 51,1 54,1 57,1 60,1 63,1 66,1 69,1 72,1 75,1 78,1 81,1 84,1 87,1 90,1 93,1 97.7,3.5 95.9,1.8 99,6 99,9 99,12 99,15 99,18 99,21 99,24 99,27 99,30 99,33 99,36 99,39 99,42 99,45 99,48 99,51 99,54 99,57 99,60 99,63 99,66 99,69 99,72 99,75 99,78 99,81 99,84 99,87 99,90 99,93 82,99 85,99 88,99 91,99 94,99 96.5,97.7 98.2,95.9 67,99 70,99 73,99 76,99 79,99 52,99 55,99 58,99 61,99 64,99 37,99 40,99 43,99 46,99 49,99 22,99 25,99 28,99 31,99 34,99 5.08,72.39 7.62,74.93 7.62,78.74 5.08,81.28 6.35,86.36 10.16,86.36 13.97,88.9 35.56,87.63 39.37,87.63 43.18,87.63 17.78,86.36 8.89,29.21 6.35,26.67 3.81,24.13 7.62,22.86 10.16,25.4 19.05,27.94 15.24,24.13 41.91,60.96 48.26,58.42 45.72,53.34 46.99,52.07 46.99,63.5 46.99,68.58 13.97,39.37 21.84,46.99 44.45,22.86 46.99,22.86 45.72,24.13 30.48,24.13 33.02,22.86 35.56,22.86 34.29,13.97 48.26,13.97 64.77,13.97 66.04,22.86 60.96,22.86 57.15,24.13 44.45,33.02 20.32,50.8 20.32,53.34 22.86,46.99 11.43,55.88 7.62,54.61 7.62,48.26 10.16,50.8 11.43,46.99 50.8,24.13 68.58,26.67 15.24,39.37 13.97,43.18 10.16,43.18 16.51,59.69 20.32,42.04 1,51.19 1,47.38 1,43.57
  pour Top: -1,101 101,101 101,-1 -1,-1
  pour Bottom (rank 2): -2,102 102,102 102,-2 -2,-2
LIMITX  (via drill 0.3)
  Top 0.254: U2.D3 28.57,37.47 | R1.2 40.64,16.66 40.64,20.83 36.83,24.64 v35.56,24.64
  Top 0.305: 28.57,37.47 30.48,39.37 33.02,39.37 35.56,41.91 35.56,45.97 SJ5.1
  Top 0.61: R1.2 C1.1 41.88,13.42 D1.C 42.38,11.77 X3.5
  Bottom 0.254: U2.D3 26.67,33.53 v35.56,24.64
LIMITY  (via drill 0.35)
  Top 0.254: R4.2 56.01,16.63 v51.69,20.95 | v38.1,33.02 31.75,33.02 U2.D2
  Top 0.305: U2.D2 29.21,36.83 30.48,38.1 33.02,38.1 36.83,41.91 36.83,49.78 SJ6.1
  Top 0.61: R4.2 C2.1 56.96,13.42 D3.C 57.62,11.61 X3.8
  Bottom 0.254: v51.69,20.95 39.62,33.02 v38.1,33.02
LIMITZ  (via drill 0.3)
  Top 0.254: U2.D4 27.94,39.37 | v27.94,19.05 27.94,18.06 R3.2
  Top 0.305: 27.94,39.37 29.21,40.64 31.75,40.64 33.27,42.16 SJ4.1
  Top 0.61: R3.2 C10.1 27.06,13.35 D11.C 27.14,12.08 X3.2
  Bottom 0.254: U2.D4 24.13,33.02 27.94,29.21 v27.94,19.05
MICRO-RX
  Top 0.406: SJ2.1 36.83,37.34 U2.RX
MICRO-TX
  Top 0.406: SJ1.1 39.37,36.07 U2.TX
N$1
  Top 0.254: ACT2.C 44.4,56.88 R7.2
N$2
  Top 0.254: ACT3.C 44.4,49.8 R8.2
N$3
  Top 0.61: D2.A 82.95,84.76 F2.2
N$4
  Bottom 0.406: U1.7 24.13,82.55 24.64,82.04 49.02,82.04 55.88,88.9 68.58,88.9 71.12,91.44 X4.1
N$5
  Bottom 0.406: U1.10 16.51,82.55 18.03,81.03 49.66,81.03 56.26,87.63 69.85,87.63 73.66,91.44 73.66,96.52 72.39,97.79 68.58,97.79 66.04,95.25 X4.2
N$6
  Bottom 0.254: U1.26 35.95,75.32 JP1.8
N$7
  Bottom 0.254: U1.25 34.8,76.71 53.34,76.71 54.54,75.51 JP1.7
N$8
  Bottom 0.254: U1.24 32.89,77.34 55.06,77.34 JP1.6
N$9
  Bottom 0.254: U1.23 30.99,77.98 56.96,77.98 JP1.5
N$10
  Bottom 0.254: U1.22 29.08,78.61 58.87,78.61 JP1.4
N$11
  Bottom 0.254: U1.16 14.48,79.25 60.77,79.25 JP1.3
N$12
  Bottom 0.254: U1.14 10.29,79.88 62.68,79.88 JP1.2
N$13
  Top 0.61: X3.10 67.78,8.85 JP3.1
N$14
  Top 0.61: X3.11 72.9,6.12 JP3.2
N$15
  Top 0.61: X3.12 77.94,8.93 JP3.3
NANO-RX
  Top 0.406: SJ1.2 44.26,42.48 39.37,47.37 39.37,61.72 44.45,66.8 44.45,82.55 41.02,85.98 37.72,85.98 36.83,85.09 U1.2
NANO-TX
  Top 0.406: SJ2.2 38.1,45.21 38.1,62.23 43.18,67.31 43.18,80.01 U1.1
NLIMITX  (via drill 0.35)
  Top 0.254: U1.13 8.89,82.55 11.43,80.01 15.24,80.01 22.86,72.39 22.86,67.31 28.57,61.59
  Top 0.305: 28.57,61.59 v28.57,54.61 | v31.75,49.66 SJ5.2
  Bottom 0.305: v28.57,54.61 28.57,52.83 v31.75,49.66
NLIMITY
  Top 0.254: U1.12 11.43,82.55 12.7,81.28 16.51,81.28 25.4,72.39 25.4,67.31 29.21,63.5
  Top 0.305: 29.21,63.5 31.75,60.96 SJ6.2
NLIMITZ  (via drill 0.35)
  Top 0.254: U1.15 8.38,79.25 14.86,79.25 20.32,73.79 20.32,67.82 22.48,65.66 23.24,65.66 27.81,61.09
  Top 0.305: 27.81,61.09 v27.81,57.15 | v31.75,44.45 SJ4.2
  Bottom 0.305: v27.81,57.15 34.29,50.67 34.29,46.99 v31.75,44.45
STEP-EN
  Top 0.406: U1.11 13.97,85.97 20.32,92.32 X4.11 20.32,94.59 23.73,98 37.19,98 40.64,94.55 X4.7 44.51,97.79 58.42,97.79 60.96,95.25 X4.3
STEPX
  Top 0.406: U1.5 34.39,89 46.19,89 50.8,93.61 X4.5
STEPY
  Top 0.406: U1.6 26.67,86.36 29.21,88.9 29.5,89.19 30.48,90.17 X4.9

### Text on the board
tPlace: GND | EN | DIRY | STPY | GND | EN | DIRX | STPX | GND | EN | DIRZ | STPZ | GND | +36V | A7 | A6 | A5 | A4 | A3 | D13 | D12 | +5V | GND | IO | SW | D11 | Y | +5V | GND | D6 | X | D5 | Z | +5V | GND | D8 | D9 | D7 | A1 | A2 | A3 | A4 | A5 | GND | LIZ | +5V | GND | LIX | +5V | GND | LIY | +5V
bPlace: GRBL Controller v1.1 | andrejspukitis.lv | edgars.dev | Mid 2020